# EAGLE design OperantFEDv7 (EAGLE 7.7.0)
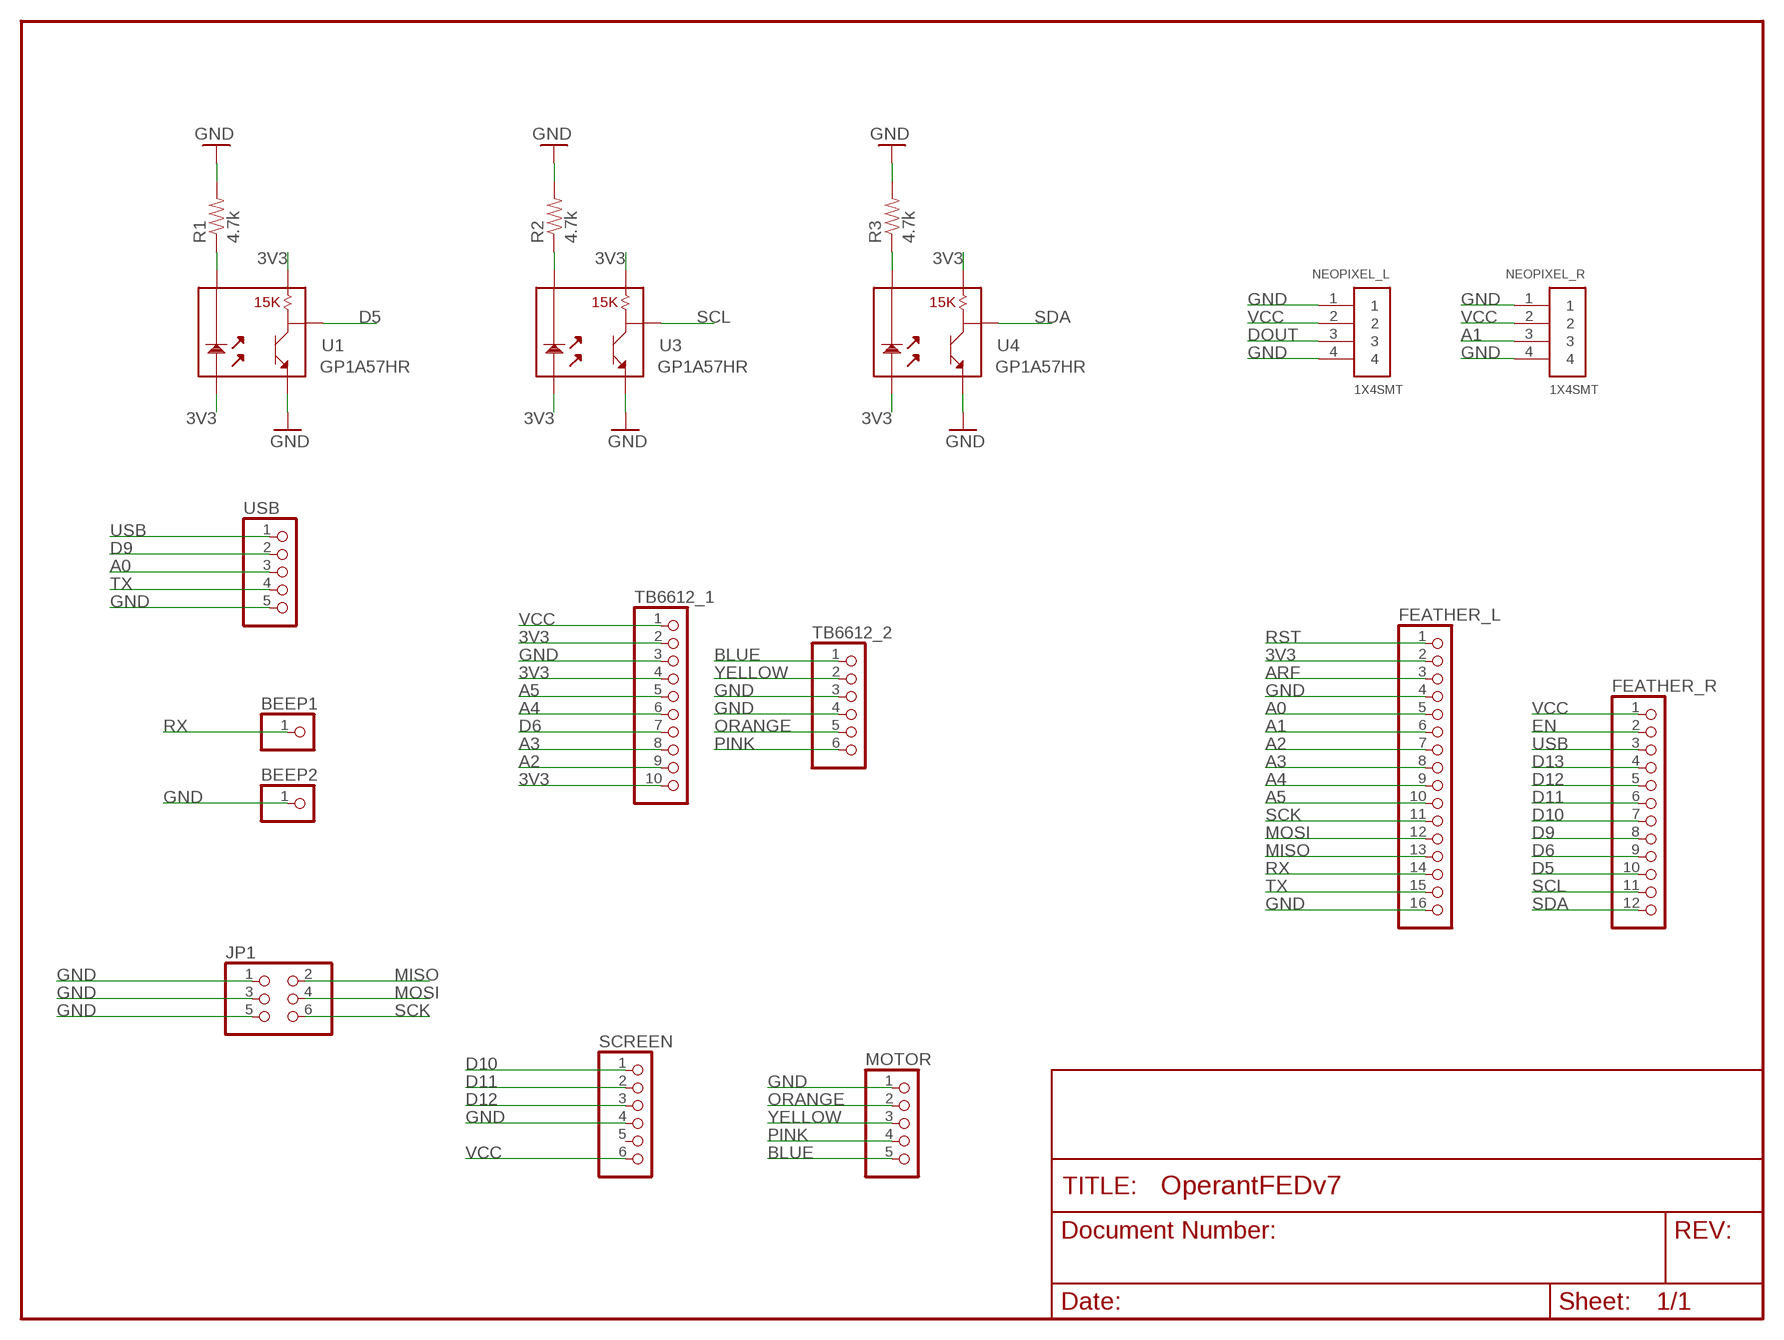
[diagram p0: schematic, sheet 1]

## Parts
BEEP1  PINHD-1X1  [1X01]
BEEP2  PINHD-1X1  [1X01]
FEATHER_L  PINHD-1X16  [1X16]
FEATHER_R  PINHD-1X12  [1X12]
JP1  PINHD-2X3  [2X03]
MOTOR  PINHD-1X5  [1X05]
NEOPIXEL_L  1X4SMT  [1X4-SMT]
NEOPIXEL_R  1X4SMT  [1X4-SMT]
R1  4.7k  RESISTORPTH1  [AXIAL-0.3]
R2  4.7k  RESISTORPTH1  [AXIAL-0.3]
R3  4.7k  RESISTORPTH1  [AXIAL-0.3]
SCREEN  PINHD-1X6  [1X06]
TB6612_1  PINHD-1X10  [1X10]
TB6612_2  PINHD-1X6  [1X06]
U1  GP1A57HR  [GP1A57HR]
U3  GP1A57HR  [GP1A57HR]
U4  GP1A57HR  [GP1A57HR]
USB  PINHD-1X5  [1X05]

## Nets
3V3: FEATHER_L.2 TB6612_1.2 TB6612_1.4 TB6612_1.10 U1.1 U1.3 U3.1 U3.3 U4.1 U4.3
A0: FEATHER_L.5 USB.3
A1: FEATHER_L.6 NEOPIXEL_R.3
A2: FEATHER_L.7 TB6612_1.9
A3: FEATHER_L.8 TB6612_1.8
A4: FEATHER_L.9 TB6612_1.6
A5: FEATHER_L.10 TB6612_1.5
ARF: FEATHER_L.3
BLUE: MOTOR.5 TB6612_2.1
D5: FEATHER_R.10 U1.4
D6: FEATHER_R.9 TB6612_1.7
D9: FEATHER_R.8 USB.2
D10: FEATHER_R.7 SCREEN.1
D11: FEATHER_R.6 SCREEN.2
D12: FEATHER_R.5 SCREEN.3
D13: FEATHER_R.4
DOUT: NEOPIXEL_L.3
EN: FEATHER_R.2
GND: BEEP2.1 FEATHER_L.4 FEATHER_L.16 JP1.1 JP1.3 JP1.5 MOTOR.1 NEOPIXEL_L.1 NEOPIXEL_L.4 NEOPIXEL_R.1 NEOPIXEL_R.4 R1.P$2 R2.P$2 R3.P$2 SCREEN.4 TB6612_1.3 TB6612_2.3 TB6612_2.4 U1.5 U3.5 U4.5 USB.5
MISO: FEATHER_L.13 JP1.2
MOSI: FEATHER_L.12 JP1.4
N$1: R2.P$1 U3.2
N$2: R1.P$1 U1.2
N$3: R3.P$1 U4.2
ORANGE: MOTOR.2 TB6612_2.5
PINK: MOTOR.4 TB6612_2.6
RST: FEATHER_L.1
RX: BEEP1.1 FEATHER_L.14
SCK: FEATHER_L.11 JP1.6
SCL: FEATHER_R.11 U3.4
SDA: FEATHER_R.12 U4.4
TX: FEATHER_L.15 USB.4
USB: FEATHER_R.3 USB.1
VCC: FEATHER_R.1 NEOPIXEL_L.2 NEOPIXEL_R.2 SCREEN.6 TB6612_1.1
YELLOW: MOTOR.3 TB6612_2.2
Unconnected: SCREEN.5

## Library data of the parts
BEEP1 BEEP2 = pinhead:PINHD-1X1: PIN HEADER
FEATHER_L = pinhead:PINHD-1X16: PIN HEADER
FEATHER_R = pinhead:PINHD-1X12: PIN HEADER
JP1 = pinhead:PINHD-2X3: PIN HEADER
MOTOR USB = pinhead:PINHD-1X5: PIN HEADER
NEOPIXEL_L NEOPIXEL_R = adafruit:1X4: 4-pin connector
R1-R3 = SparkFun:RESISTOR: Resistor Basic schematic elements and footprints for 0603, 1206, and PTH 1/10th watt (small) resistors.
SCREEN TB6612_2 = pinhead:PINHD-1X6: PIN HEADER
TB6612_1 = pinhead:PINHD-1X10: PIN HEADER
U1 U3 U4 = SparkFun:GP1A57HR

## Board
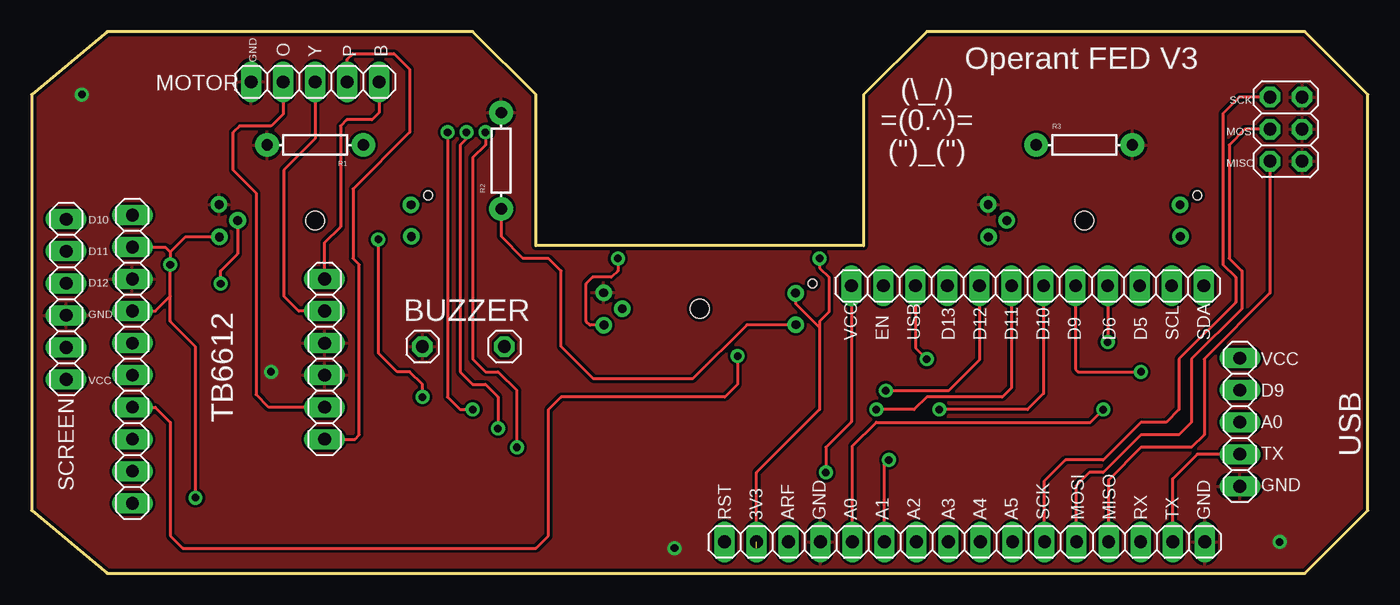
[diagram p1: board, top side]
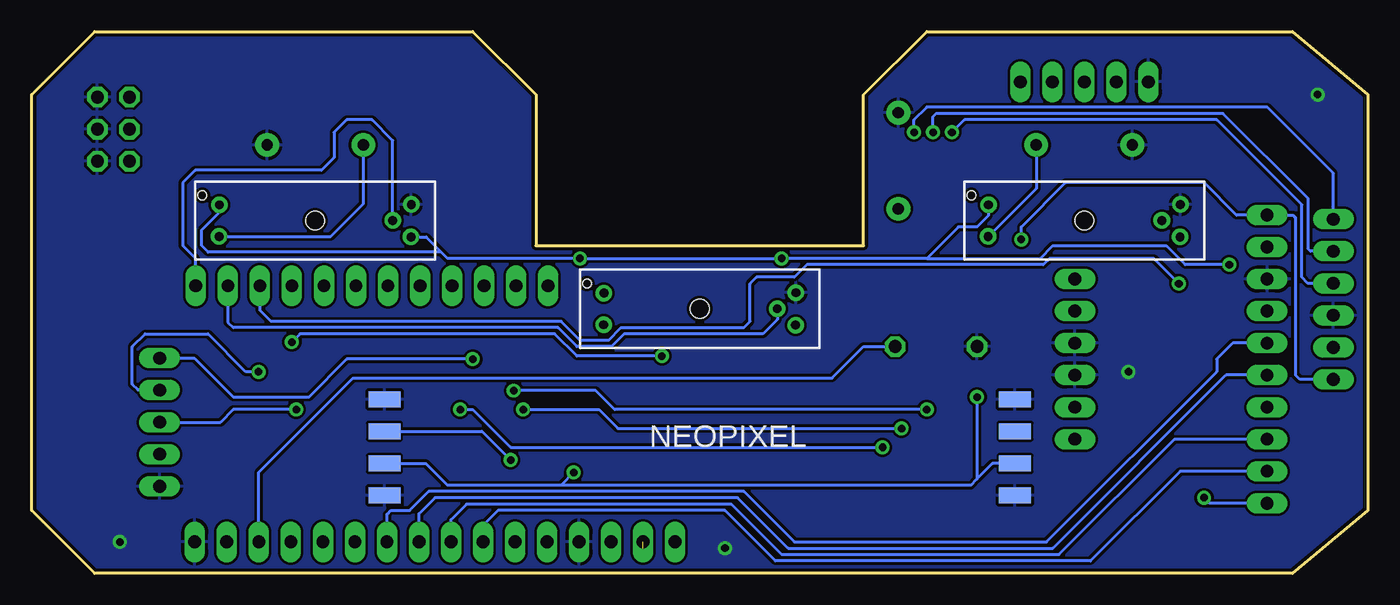
[diagram p2: board, bottom side, seen from below]

Size 106 x 43 mm. Coordinates in mm from the lower left corner, seen from the top.
Outline: 6,0 101,0 106,5 106,38 101,43 71,43 66,38 66,26 40,26 40,38 35,43 6,43 0,38 0,5 6,0
Copper layers (1*16): Top 0.0356mm / dielectric 1.5011mm / Bottom 0.0356mm
Design rules "default": minimum track width 8mil, minimum drill 20mil, track to track 8mil, track to pad 8mil, pad to pad 8mil, via to via 8mil, smd to smd 8mil, copper to edge 10mil, drill to drill 8mil, minimum pad ring 12mil, minimum via ring 10mil, stop-mask expansion 4mil, vias tented up to drill 20mil, thermal gap 10mil

### Footprints (pad centres in the part's own frame; a part is rotated, then mirrored left to right if it is on the bottom)
1X01 = drill 1.016 octagon: 1 0,0
1X16 = drill 1.016 long: 1 -19.05,0; 2 -16.51,0; 3 -13.97,0; 4 -11.43,0; 5 -8.89,0; 6 -6.35,0; 7 -3.81,0; 8 -1.27,0; 9 1.27,0; 10 3.81,0; 11 6.35,0; 12 8.89,0; 13 11.43,0; 14 13.97,0; 15 16.51,0; 16 19.05,0
1X12 = drill 1.016 long: 1 -13.97,0; 2 -11.43,0; 3 -8.89,0; 4 -6.35,0; 5 -3.81,0; 6 -1.27,0; 7 1.27,0; 8 3.81,0; 9 6.35,0; 10 8.89,0; 11 11.43,0; 12 13.97,0
2X03 = drill 1.016 octagon: 1 -2.54,-1.27; 2 -2.54,1.27; 3 0,-1.27; 4 0,1.27; 5 2.54,-1.27; 6 2.54,1.27
1X05 = drill 1.016 long: 1 -5.08,0; 2 -2.54,0; 3 0,0; 4 2.54,0; 5 5.08,0
1X4-SMT = smd 1.27 x 2.54: 1 -3.81,0; 2 -1.27,0; 3 1.27,0; 4 3.81,0
AXIAL-0.3 = drill 0.9 pad 1.88: P$1 -3.81,0; P$2 3.81,0
1X06 = drill 1.016 long: 1 -6.35,0; 2 -3.81,0; 3 -1.27,0; 4 1.27,0; 5 3.81,0; 6 6.35,0
1X10 = drill 1.016 long: 1 -11.43,0; 2 -8.89,0; 3 -6.35,0; 4 -3.81,0; 5 -1.27,0; 6 1.27,0; 7 3.81,0; 8 6.35,0; 9 8.89,0; 10 11.43,0
GP1A57HR = drill 0.7: 1 -7.6,1.24; 2 -7.62,-1.27; 3 7.6,-1.3; 4 6.15,0; 5 7.62,1.27 | hole 1.5: 0,0 | hole 0.7: -8.95,2

### Placement (x,y rotation side)
BEEP1  37.5,18 0 top
BEEP2  31,18 0 top
FEATHER_L  74,2.5 0 top
FEATHER_R  79,22.82 0 top
JP1  99.5,35.25 90 top
MOTOR  22.5,39 0 top
NEOPIXEL_L  28,10 90 bottom
NEOPIXEL_R  78,10 90 bottom
R1  22.5,34 180 top
R2  37.25,32.75 90 top
R3  83.5,34 0 top
SCREEN  2.75,21.75 270 top
TB6612_1  8,17 270 top
TB6612_2  23.24,17 270 top
U1  22.5,28 0 bottom
U3  53,21 0 bottom
U4  83.5,28 0 bottom
USB  95.84,12 270 top

### Tracks (layer width: path | path; a pad name or v marks a point on that pad's centre or on a via)
3V3  (via drill 0.6, 0.6 pad 0.61)  (1 unrouted)
  Top 0.254: 11,22 11,20 13,18 v13,6 | 11,22 v11,24.5 11,25.5 | v46.5,25 46.5,24 46,23.5 44.5,23.5 44,23 44,20 44.3,19.7 U3.3 | 62.5,19.5 62.5,20 63.25,20.75 63.25,23.5 62.5,24.25 v62.5,25 | 62.5,19.5 62.5,13 57.5,8 57.5,2 | TB6612_1.4 9.81,20.81 11,22 | TB6612_1.2 10.61,25.89 11,25.5 | U1.3 12.2,26.7 11,25.5 | U3.1 60.6,21.4 62.5,19.5
  Bottom 0.254: 35,25 v46.5,25 v62.5,25 73,25 73.5,25.5 | 35,25 32.5,27.5 31,27.5 30.1,28.4 U1.1 | U4.1 91.1,28.65 92.5,27.25 92.5,26 92,25.5 73.5,25.5 | U4.3 74.7,26.7 73.5,25.5 | TB6612_1.10 12.57,5.57 v13,6 | v11,24.5 14.5,24.5 16,26 25,26 26,25 35,25
A0  (via drill 0.6)
  Top 0.254: FEATHER_L.5 65.11,10.11 67,12 84,12 v85,13
  Bottom 0.254: v85,13 90,13 91,12 USB.3
A1  (via drill 0.6)
  Top 0.254: FEATHER_L.6 67.65,8.65 v68,9
  Bottom 0.254: v68,9 70.27,11.27 NEOPIXEL_R.3
A2
  Bottom 0.254: FEATHER_L.7 70.19,3.81 69,5 51,5 47,1 22,1 14.89,8.11 TB6612_1.9
A3
  Bottom 0.254: FEATHER_L.8 72.73,4.27 71.5,5.5 50.5,5.5 46.5,1.5 24.5,1.5 15.35,10.65 TB6612_1.8
A4
  Bottom 0.254: FEATHER_L.9 75.27,4.73 74,6 50,6 46,2 25,2 11.27,15.73 TB6612_1.6
A5
  Bottom 0.254: TB6612_1.5 10.73,18.27 12,17 12,16 25.5,2.5 45.5,2.5 49.5,6.5 74.5,6.5 76,5 77.5,5 77.81,4.69 FEATHER_L.10
BLUE
  Top 0.254: MOTOR.5 27.58,36.58 27,36 25,36 24.5,35.5 24.5,27.5 23.24,26.24 TB6612_2.1
D5  (via drill 0.6)
  Top 0.254: v15,23 15,24 16.35,25.35 U1.4
  Bottom 0.254: v15,23 17,25 25.25,25 25.75,24.5 44.5,24.5 45.5,23.5 48.5,23.5 49,23 49,20 49.5,19.5 59.25,19.5 60.25,18.5 62.5,18.5 64,20 87,20 87.89,20.89 FEATHER_R.10
D6  (via drill 0.6)
  Top 0.254: TB6612_1.7 9.81,13.19 11,12 11,3 12,2 40,2 41,3 41,13 42,14 55,14 56,15 v56,17.25 | FEATHER_R.9 v85.35,18.35
  Bottom 0.254: v56,17.25 62.75,17.25 64.5,19 84.7,19 v85.35,18.35
D9  (via drill 0.6)
  Top 0.254: FEATHER_R.8 82.81,16.19 83,16 v88,16
  Bottom 0.254: v88,16 89,16 92,19 97,19 98,18 98,15 97.54,14.54 USB.2
D10  (via drill 0.6)
  Top 0.254: FEATHER_R.7 80.27,14.27 79,13 v72,13 | v38.5,10 38.5,14.5 37,16 36,16 35,17 35,33 36,34 v36,35
  Bottom 0.254: v38.5,10 68,10 71,13 v72,13 | SCREEN.1 2.75,31.75 8,37 35,37 36,36 v36,35
D11  (via drill 0.6)
  Top 0.254: FEATHER_R.6 77.73,14.73 77,14 71,14 70,13 v67,13 | v37,11.5 37,14 36,15 35,15 34,16 34,34 34.5,34.5 v34.5,35
  Bottom 0.254: v67,13 61,13 59.5,11.5 v37,11.5 | SCREEN.2 4.56,25.56 4.75,25.75 4.75,29.75 11.5,36.5 34.25,36.5 34.5,36.25 v34.5,35
D12  (via drill 0.6)
  Top 0.254: FEATHER_R.5 75.19,16.94 72.75,14.5 v67.75,14.5 | v35,13 34,13 33,14 v33,35
  Bottom 0.254: v33,35 32,36 12,36 5.25,29.25 5.25,23.5 4.77,23.02 SCREEN.3 | v35,13 59.75,13 61.25,14.5 v67.75,14.5
GND  (via drill 0.6 pad 0.81)
  other vias: 99,2.5 51,2 19,16 4,38
  pour Top: 0,38 6,43 35,43 40,38 40,26 66,26 66,38 71,43 101,43 106,38 106,5 101,0 6,0 0,5
  pour Bottom: 0,38 6,43 35,43 40,38 40,26 66,26 66,38 71,43 101,43 106,38 106,5 101,0 6,0 0,5
MISO
  Top 0.254: FEATHER_L.13 85.43,7.43 88,10 92,10 93,11 93,17 98.23,22.23 JP1.2
MOSI
  Top 0.254: FEATHER_L.12 82.89,7 83.89,8 85,8 88,11 91,11 92,12 92,17 96,21 96,24 95,25 95,34 96.25,35.25 JP1.4
N$1
  Top 0.254: U3.2 56.73,19.73 52.44,15.44 44.56,15.44 42,18 42,24 41,25 39,25 37.25,26.75 R2.P$1
N$2
  Bottom 0.254: R1.P$1 26.31,30.54 U1.2
N$3
  Bottom 0.254: U4.2 82.27,26.73 79.69,29.31 R3.P$1
ORANGE
  Top 0.254: MOTOR.2 19.96,36.46 19,35.5 16.5,35.5 16,35 16,32 17.81,30.19 17.81,14.19 18.81,13.19 TB6612_2.5
PINK
  Top 0.254: MOTOR.4 25.04,40.79 25.5,41.25 28.75,41.25 30,40 30,35 25.5,30.5 25.5,25 26,24.5 26,11 25.65,10.65 TB6612_2.6
RX
  Bottom 0.254: FEATHER_L.14 87.97,8.03 80.5,15.5 42.5,15.5 40,18 BEEP1.1
SCK
  Top 0.254: FEATHER_L.11 80.35,7.35 82,9 85,9 88,12 90,12 91,13 91,17 95.5,21.5 95.5,23.5 94.5,24.5 94.5,36.5 95.79,37.79 JP1.6
SCL
  Bottom 0.254: U3.4 46.85,20.15 48,19 59,19 60,18 62.75,18 64.25,19.5 90,19.5 90.43,19.93 FEATHER_R.11
SDA
  Bottom 0.254: U4.4 77.35,34.35 79,36 81,36 82,35 82,33 83,32 93,32 94,31 94,26 92.97,24.97 FEATHER_R.12
TX
  Top 0.254: FEATHER_L.15 90.51,7.51 92.46,9.46 USB.4
USB  (via drill 0.6)
  Top 0.254: FEATHER_R.3 70.11,17.89 v71,17
  Bottom 0.254: v71,17 81,17 84,14 90,14 93.08,17.08 USB.1
VCC  (via drill 0.6)
  Top 0.254: v27.5,26.5 27.5,17.5 29,16 30,16 31,15 v31,14 | FEATHER_R.1 65.03,12.03 63,10 v63,8
  Bottom 0.254: 64,7 31.5,7 31,7.5 | 64,7 73,7 74.73,8.73 NEOPIXEL_R.2 | 31,7.5 29.77,8.73 NEOPIXEL_L.2 | v27.5,26.5 27.5,27.5 24,31 13,31 10.43,28.43 TB6612_1.1 5.93,28.43 5.75,28.25 5.75,15.75 5.4,15.4 SCREEN.6 | v31,14 31,7.5 | v63,8 64,7
YELLOW
  Top 0.254: MOTOR.3 22.5,34.5 20,32 20,22 21.19,20.81 TB6612_2.2

### Text on the board
tNames: GND | O | Y | P | B | Operant FED V3 | SCK | (\\_/) / =(0.^)= / (")_(") | MOSI | MISO | D10 | D11 | D12 | GND | BUZZER | VCC | EN | USB | D13 | D12 | D11 | D10 | D9 | D6 | D5 | SCL | SDA | VCC | VCC | D9 | TB6612 | A0 | TX | GND | RST | 3V3 | ARF | GND | A0 | A1 | A2 | A3 | A4 | A5 | SCK | MOSI | MISO | RX | TX | GND
bNames: NEOPIXEL